# Altium schematic sheet PC104_Connectors.SchDoc
size Letter; SheetNumber: 2; SheetTotal: 11
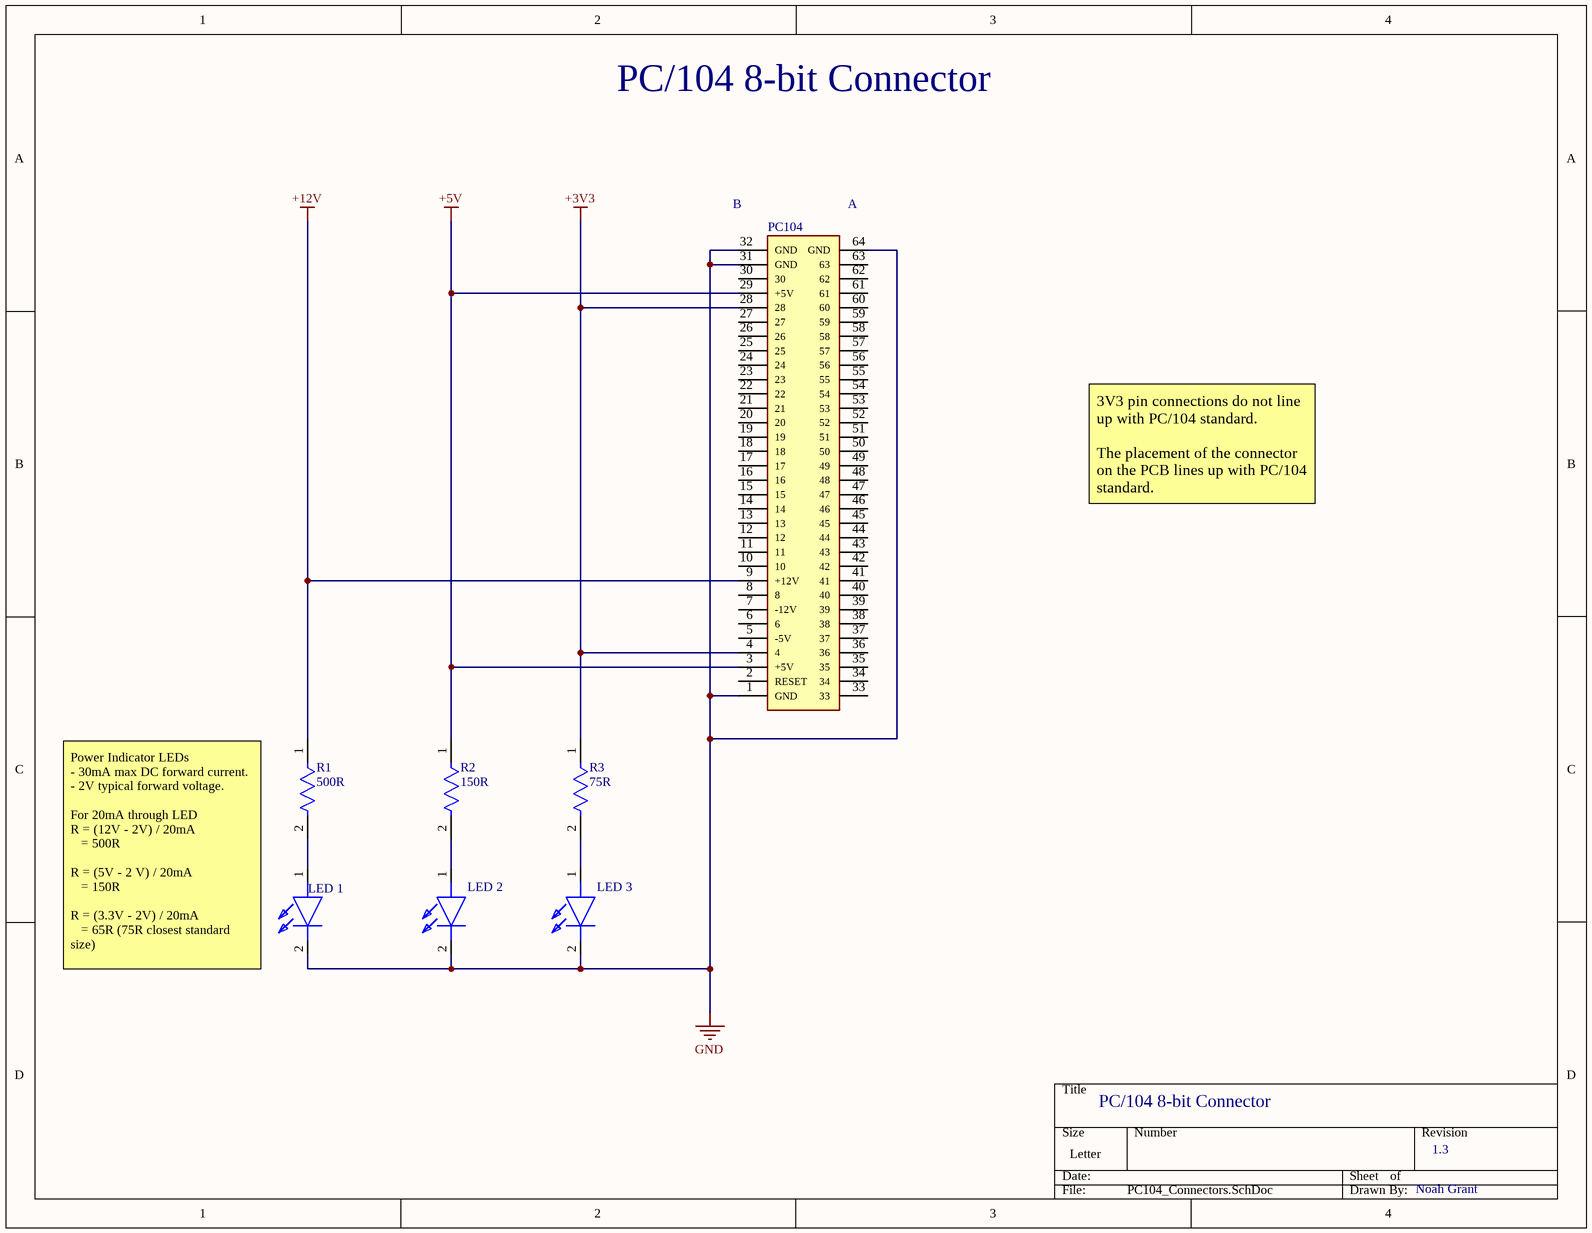
[diagram p0: PC104_Connectors.SchDoc]

## Parts
LED_1  APL3015EC-F01  [APL3015ECF01]  (value not drawn)
LED_2  APL3015EC-F01  [APL3015ECF01]  (value not drawn)
LED_3  APL3015EC-F01  [APL3015ECF01]  (value not drawn)
PC104  10153302-32111LF  [RHDR64W74P254_2X32_8238X499X1115P]  (value not drawn)
R1  500R  [FP-TFCR0603-IPC_A]
R2  150R  [FP-MCT0603-IPC_C]
R3  75R  [FP-RT0603-MFG]

## Nets
+3V3: PC104.4 PC104.28 R3.1
+5V: PC104.3(+5V) PC104.29(+5V) R2.1
+12V: PC104.9(+12V) R1.1
GND: LED_1.2(K) LED_2.2(K) LED_3.2(K) PC104.1(GND) PC104.31(GND) PC104.32(GND) PC104.64(GND)
NetLED_1_1: LED_1.1(A) R1.2
NetLED_2_1: LED_2.1(A) R2.2
NetLED_3_1: LED_3.1(A) R3.2

Not connected (* = marked no-connect by the designer): PC104 2(RESET) 5(-5V) 6 7(-12V) 8 10 11 12 13 14 15 16 17 18 19 20 21 22 23 24 25 26 27 30 33 34 35 36 37 38 39 40 41 42 43 44 45 46 47 48 49 50 51 52 53 54 55 56 57 58 59 60 61 62 63

## Notes on the sheet
- PC/104 8-bit Connector
- (near PC104) B
- (near PC104) A
- 3V3 pin connections do not line up with PC/104 standard.
  The placement of the connector on the PCB lines up with PC/104 standard.
- Power Indicator LEDs
  - 30mA max DC forward current.
  - 2V typical forward voltage.
  For 20mA through LED
  R = (12V - 2V) / 20mA
  = 500R
  R = (5V - 2 V) / 20mA
  = 150R
  R = (3.3V - 2V) / 20mA
  = 65R (75R closest standard size)
- 1.3
- Noah Grant

## Library data of the parts
LED_1-LED_3 = APL3015EC-F01: LED; Manufacturer_Name: Kingbright; Datasheet Link: https://componentsearchengine.com/Datasheets/1/APL3015EC-F01.pdf; Manufacturer_Part_Number: APL3015EC-F01; Mouser Part Number: 604-APL3015EC-F01; Mouser Price/Stock: https://www.mouser.co.uk/ProductDetail/Kingbright/APL3015EC-F01?qs=VdjlWU%2FzoOF91deOgS6C3g%3D%3D
PC104 = 10153302-32111LF: Connector; Manufacturer_Name: Amphenol Communication Solutions; Datasheet Link: https://cdn.amphenol-cs.com/media/wysiwyg/files/drawing/10153302.pdf; Height: 11.15mm; Manufacturer_Part_Number: 10153302-32111LF
R1 = CMP-250906-063952-1: RES Thin Film,  500Ω, 0.1%, 0.1W, 25ppm/°C, 0603; RoHS Compliant: Yes
R2 = CMP-02407-011712-1: RES SMD 150 OHM 1% 1/8W 0603; Power Rating: 125mW; Tolerance: 0.5%; Voltage Rating: 75V; Max Power Dissipation: 150mW; Temperature Coefficient: 25ppm/°C; Resistance: 150R; Packaging: Tape and Reel; Termination: SMD/SMT; Construction: Rectangular; Max Operating Temperature: 175°C; Length: 0.061inch; Case/Package: 0603; Depth: 0.85mm; Military Standard: Not; Case Code (Metric): 1608; Package Quantity: 1; Width: 0.8mm; Features: Automotive AEC-Q200; Height: 0.022inch; REACH SVHC: No SVHC; Min Operating Temperature: -55°C; Resistor Type: Thin Film; RoHS Compliant: Yes; Resistance Tolerance: 0.5%; Series: MCT 0603 - Professional; Voltage Rating (DC): 75V; Number of Terminations: 2; Case Code (Imperial): 0603; Number of Pins: 2
R3 = CMP-2000-04797-2: RES SMD 75 OHM 1% 1/10W 0603; Manufacturer: Yageo; Manufacturer Part Number: RT0603FRE0775RL; Resistance: 75Ω; Voltage Rating: 75V; Tolerance: 0.01; Value: 75Ω; Power Rating: 0.1W; Temperature Coefficient: 50 ppm/°C; Ipc Land Pattern Name: RESC16080X45; Height: 0.55mm; Lead Free: Yes; Mouser Description: Res Thin Film 0603 75 Ohm 1% 1/10W ±50ppm/°C Molded SMD SMD Paper T/R; Device Class L2: Resistors; Device Class L1: Passive Components; Series: RT; Composition: Thin Film; Automotive: No; Footprint Url: http://www.yageo.com/exep/pages/download/literatures/PYu-R_Mount_10.pdf; Temperature: -55°C to +155°C; Temperature Range High: +155°C; Temperature Range Low: -55°C; ComponentLink2URL: http://www.yageo.com/documents/recent/PYu-RT_1-to-0.01_RoHS_L_9.pdf; Device Class L3: Chip SMD Resistors; Octopart: https://octopart.com/rt0603fre0775rl-yageo-1163751; ComponentLink2Description: Datasheet; RoHS: TRUE; Digikey Description: RES SMD 75 OHM 1% 1/10W 0603; Category: Res; Package: RT0603